# Altium schematic sheet Morpheus_MCU.SchDoc: Bluetooth Low Energy MCU
size Letter; Author: Dyke Shaffer; CompanyName: Hello, Inc.; Engineer: Dyke Shaffer; Organization: Hello, Inc.; Revision: DVT; SheetNumber: 4; SheetTotal: 4
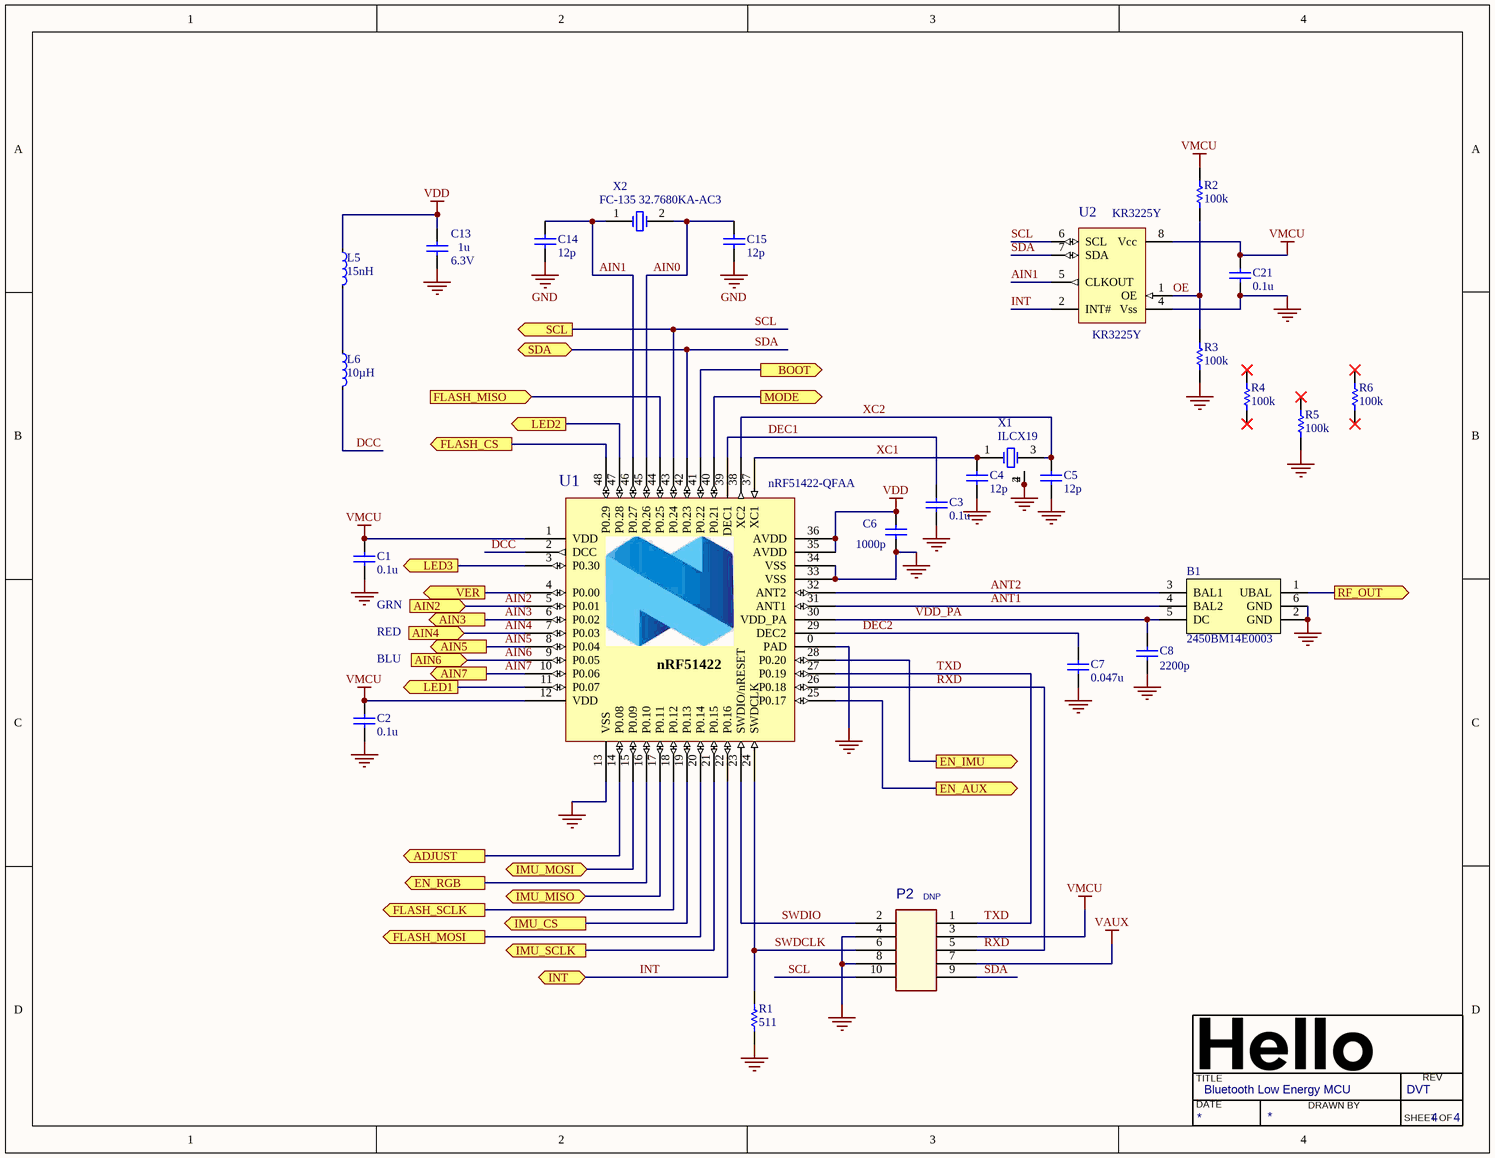
[diagram p0: Morpheus_MCU.SchDoc]

## Parts
B1  2450BM14E0003  [DFN50P160X80X70-6N]
C1  0.1u  [CAP0402_SENSE_DVT]
C2  0.1u  [CAP0402_SENSE_DVT]
C3  0.1u  [CAP0402_SENSE_DVT]
C4  12p  [CAP0402_SENSE_DVT]
C5  12p  [CAP0402_SENSE_DVT]
C6  1000p  [CAP0402_SENSE_DVT]
C7  value 0.047u  [CAP0402_SENSE_DVT]  (hidden comment: C_0.047u_10_16_X5R_0201)
C8  2200p  [CAP0402_SENSE_DVT]
C13  1u  Voltage: 6.3V  [CAP0402_SENSE_DVT]
C14  12p  [CAP0402_SENSE_DVT]
C15  12p  [CAP0402_SENSE_DVT]
C21  0.1u  [CAP0402_SENSE_DVT]
L5  15nH  [INDC1005X04L]
L6  10µH  [INDC1608X06L]
P2  DNP  [HDR1.27-2X5-N]
R1  511  [RES0402_SENSE_DVT]
R2  100k  [RES0402_SENSE_DVT]
R3  100k  [RES0402_SENSE_DVT]
R4  100k  [RES0402_SENSE_DVT]
R5  100k  [RES0402_SENSE_DVT]
R6  100k  [RES0402_SENSE_DVT]
U1  nRF51422-QFAA  [VQFN40P600X600X100-48]
U2  KR3225Y  [8-CLCC-KYOCERO]
X1  ILCX19  [ILCX19]
X2  FC-135 32.7680KA-AC3  [Epson_FC-135]

## Ports
ADJUST (out), AIN2 (in), AIN3 (out), AIN4 (in), AIN5 (out), AIN6 (in), AIN7 (out), BOOT (out), EN_AUX (out), EN_IMU (out), EN_RGB (out), FLASH_CS (out), FLASH_MISO (in), FLASH_MOSI (out), FLASH_SCLK (out), IMU_CS (out), IMU_MISO, IMU_MOSI, IMU_SCLK (out), INT (bidir), LED1 (out), LED2 (out), LED3 (out), MODE (out), RF_OUT (out), SCL (out), SDA, VER (out)

## Nets
GND: B1.2(GND) B1.6(GND) C1.1 C2.1 C3.1 C4.1 C5.1 C6.1 C7.1 C8.1 C13.1 C14.1 C15.1 C21.1 P2.4 P2.8 R1.1 R3.1 R5.1 U1.0(PAD) U1.13(VSS) U1.33(VSS) U1.34(VSS) U2.4(NC) X1.2(GND1) X1.4(XTAL2)
VAUX: P2.7
VDD: C6.2 C13.2 L5.1 U1.35(AVDD) U1.36(AVDD)
VMCU: C1.2 C2.2 C21.2 P2.3 R2.2 U1.1(VDD) U1.12(VDD) U2.8(Vcc)
ADJUST: U1.14(P0.08) ; port ADJUST
AIN0: C15.2 U1.45(P0.26) X2.2
AIN1: C14.2 U1.46(P0.27) U2.5(CLKOUT) X2.1
AIN2: U1.5(P0.01) ; port AIN2
AIN3: U1.6(P0.02) ; port AIN3
AIN4: U1.7(P0.03) ; port AIN4
AIN5: U1.8(P0.04) ; port AIN5
AIN6: U1.9(P0.05) ; port AIN6
AIN7: U1.10(P0.06) ; port AIN7
ANT1: B1.4(BAL2) U1.31(ANT1)
ANT2: B1.3(BAL1) U1.32(ANT2)
BOOT: U1.41(P0.22) ; port BOOT
DCC: L6.2 U1.2(DCC)
DEC1: C3.2 U1.39(DEC1)
DEC2: C7.2 U1.29(DEC2)
EN_AUX: U1.25(P0.17) ; port EN_AUX
EN_IMU: U1.28(P0.20) ; port EN_IMU
EN_RGB: U1.16(P0.10) ; port EN_RGB
FLASH_CS: U1.48(P0.29) ; port FLASH_CS
FLASH_MISO: U1.44(P0.25) ; port FLASH_MISO
FLASH_MOSI: U1.20(P0.14) ; port FLASH_MOSI
FLASH_SCLK: U1.18(P0.12) ; port FLASH_SCLK
IMU_CS: U1.19(P0.13) ; port IMU_CS
IMU_MISO: U1.17(P0.11) ; port IMU_MISO
IMU_MOSI: U1.15(P0.09) ; port IMU_MOSI
IMU_SCLK: U1.21(P0.15) ; port IMU_SCLK
INT: U1.22(P0.16) U2.2(INT#) ; port INT
LED1: U1.11(P0.07) ; port LED1
LED2: U1.47(P0.28) ; port LED2
LED3: U1.3(P0.30) ; port LED3
MODE: U1.40(P0.21) ; port MODE
OE: R2.1 R3.2 U2.1(OE)
RF_OUT: B1.1(UBAL) ; port RF_OUT
RXD: P2.5 U1.26(P0.18)
SCL: P2.10 U1.43(P0.24) U2.6(SCL) ; port SCL
SDA: P2.9 U1.42(P0.23) U2.7(NC) ; port SDA
SWDCLK: P2.6 R1.2 U1.24(SWDCLK)
SWDIO: P2.2 U1.23(SWDIO/nRESET)
TXD: P2.1 U1.27(P0.19)
VDD_PA: B1.5(DC) C8.2 U1.30(VDD_PA)
VER: U1.4(P0.00) ; port VER
XC1: C4.2 U1.37(XC1) X1.1(XTAL1)
XC2: C5.2 U1.38(XC2) X1.3(XTAL2)
NetL5_2: L5.2 L6.1

Not connected (* = marked no-connect by the designer): R4 1* 2*; R5 2*; R6 1* 2*

## Notes on the sheet
- (near C1) GRN
- RED
- (near C2) BLU
- TITLE
- DATE
- DRAWN BY
- REV
- SHEET
- OF
- (in symbol nRF51422_QFAA) nRF51422

## Library data of the parts
B1 = 2450BM14E0003: 2.45 GHz Impedance Matched Balun-Filter; Vendor: Johanson; PN: 2450BM14E0003
C1-C3 C21 = C_0.1u_10_50_X7R_0402: Chip capacitor; Vendor: Taiyo Yuden; PN: UMK105B7104KV-FR; Tolerance: 10%; Voltage: 50V; Temp: X7R; Value: 0.1u; Size: 0402
C4 C5 C14 C15 = C_12p_5_50_C0G_0402: Chip capacitor; Vendor: Murata; PN: GRM1555C1H120JA01D; Tolerance: 5%; Voltage: 50V; Temp: C0G; Value: 12p; Size: 0402
C6 = C_1000p_10_25_X7R_0201: Chip capacitor; Vendor: Taiyo Yuden; PN: TMK063B7102KP-F; Tolerance: 10%; Voltage: 25V; Temp: X7R; Value: 1000p; Size: 0201
C7 = C_0.047u_10_16_X5R_0201: Chip capacitor; Vendor: Murata; PN: GRM033R61C473KE84D; Tolerance: 10%; Voltage: 16V; Temp: X5R; Size: 0201
C8 = C_2200p_5_16_X7R_0201: Chip capacitor; Vendor: Murata; PN: GRM033R71C222KA88D; Tolerance: 5 %; Voltage: 16V; Type: X7R; Value: 2200p; Size: 0201
C13 = C_1u_10_6.3_X5R_0402: Chip capacitor; Vendor: Taiyo Yuden; PN: JMK105BJ105KV-F; Tolerance: 10%; Temp: X5R; Value: 1u; Size: 0402
L5 = L0402-15n: Inductor, 320mA, ±5%; Manufacturer: Taiyo Yuden; Manufacturer Part Number: HK100515NJ-T; 2nd source part number: 658-1328; Note: High frequency chip inductor ±10%; Artikkelnr Noca: 33029323; Artikkelnr Simpro: N.A.; Part Number: L0402-15n; LatestRevisionDate: 2012-09-19; Pin Count: 2; Publisher: Nordic Semiconductor; Published: 2010-07-12; Value: 15nH; Supplier: Digi-Key; Datasheet: http://www.yuden.co.jp/productdata/catalog/en/mlci04_e.pdf; Supplier part number: 587-1521-1-ND; 2nd source Supplier: Farnell; Footprint Doc: 0402
L6 = L0603-10µ: Inductor, 80mA, ±10%; Manufacturer: Taiyo Yuden; Manufacturer Part Number: LBMF1608T100K; 2nd source part number: 178-6105; Note: LBMF1608T100K 10µH 80mA 0603; Artikkelnr Noca: 33029314; Artikkelnr Simpro: N.A.; Part Number: L0603-10µ; Datasheet: http://www.yuden.co.jp/ut/product/pdf/elb2_e.pdf; LatestRevisionDate: 2012-09-19; Pin Count: 2; Publisher: Nordic Semiconductor; Published: 2010-02-24; Value: 10µH; Supplier: Digi-Key; Supplier part number: 587-1714-1-ND; 2nd source Supplier: Farnell; Footprint Doc: 0603
P2 = CON10A: part_name: CONN HDR 1.27MM VERT AU 12 POS; manufacturer information: Harwin, Inc.; suggested vendor p/n: M50-3500642; distributor p/n: 952-1384-ND; distributor: Digikey
R1 = R_511_1_0.1_0402: Chip Resistor; Vendor: Panasonic; Tolerance: 1 %; Power: 0.1 W; PN: ERJ-2RKF5110X; Model: *; Value: 511; Size: 0402
R2-R6 = R_100k_1_0.1_0402: Chip Resistor; Vendor: Panasonic; Tolerance: 1 %; Power: 0.1 W; PN: ERJ-2RKF1003X; Model: *; Value: 100k; Size: 0402
U1 = nRF51422_QFAA: Multi-protocol Bluetooth Low Energy, ANT and 2.4GHz proprietary system-on-chip; Vendor: Nordic Semiconductor; PN: nRF51422-QFAA
U2 = KR3225Y32768DGR: Kyocero I2C RTC w/ Crystal; PN: KR3225Y
X1 = ILCX19: ILSI ILCX19 Crystal Oscillator; PN: ILCX19
X2 = Espon_FC-135 32.7680KA-AC3: Epson 32kHz crystal, 9pF; PN: FC-135 32.7680KA-AC3; Vendor: Epson